# Altium project DoorCard_v0.1.PrjPcb
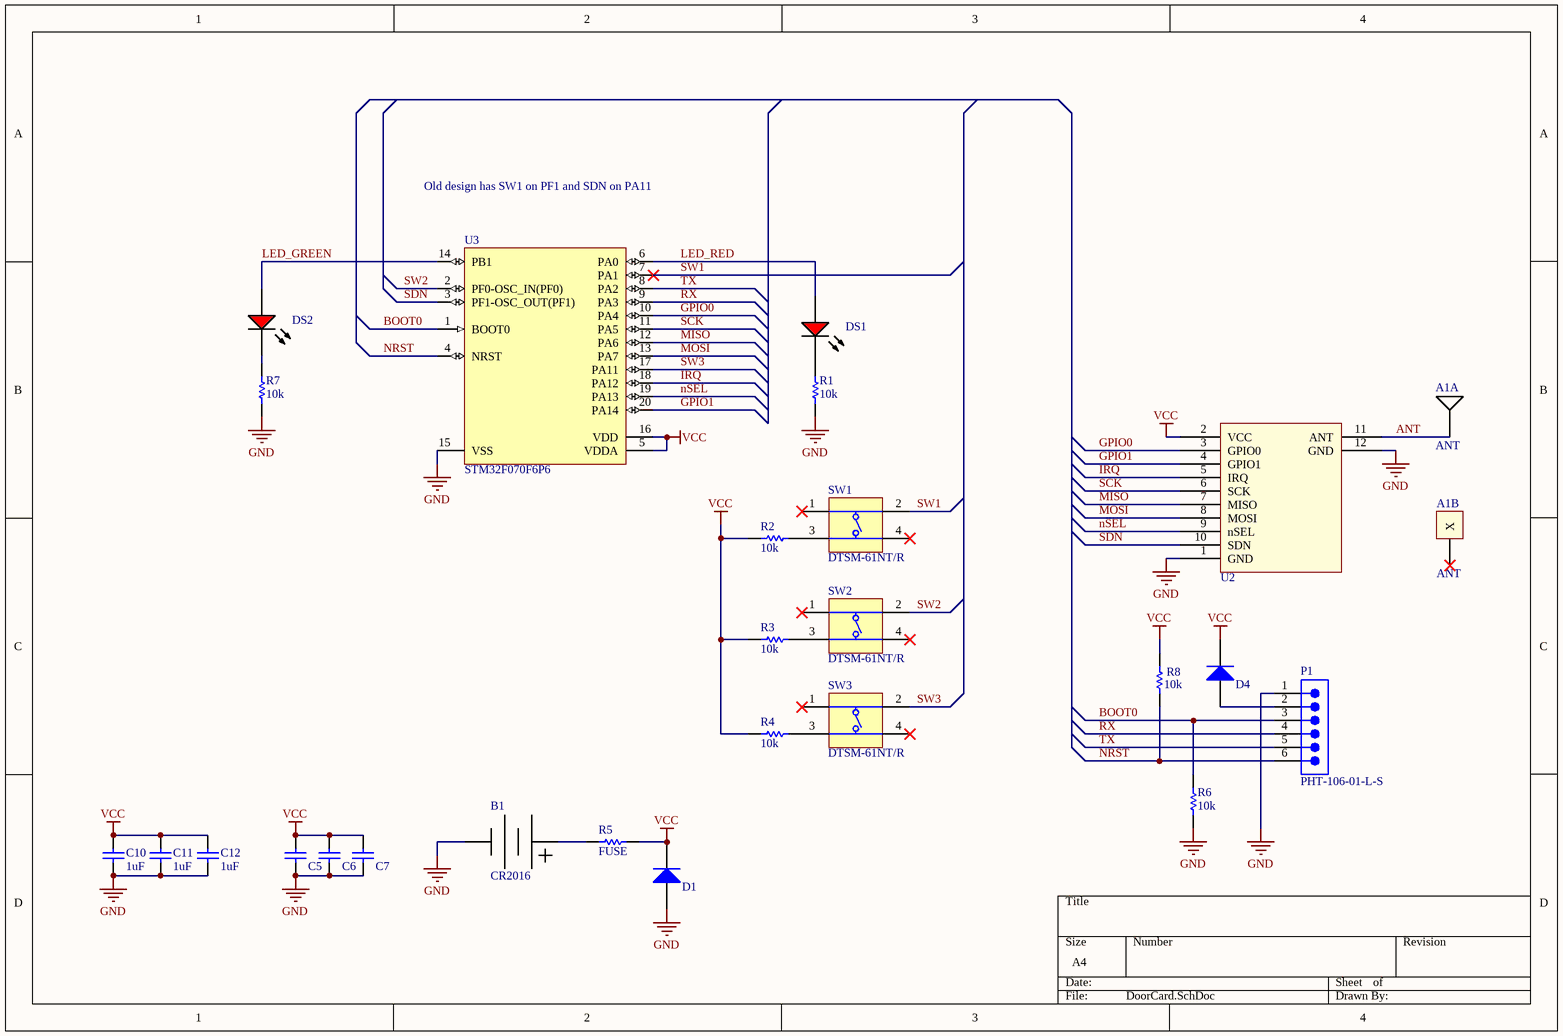
[diagram p0: DoorCard.SchDoc]
1 sheet, 26 parts. Net scope: global (net labels, ports and power ports of the same name join across sheets).
Board file: doorCard.PcbDoc

## Sheet DoorCard.SchDoc
size A4

### Parts
A1  ANT  [433MHz_Antenna]  (parts A,B of 2)
B1  CR2016  [CR2012]
C5  CAP 47uF 6.3V 1206(3216)  [CAPC1206(3216)190_M]  (value not drawn)
C6  CAP 47uF 6.3V 1206(3216)  [CAPC1206(3216)190_M]  (value not drawn)
C7  CAP 47uF 6.3V 1206(3216)  [CAPC1206(3216)190_M]  (value not drawn)
C10  1uF  [CAPC0805(2012)100_M]
C11  1uF  [CAPC0805(2012)100_M]
C12  1uF  [CAPC0805(2012)100_M]
D1  MMSD4148T3G  [ONSC-SOD123-2-425G-04_V]  (value not drawn)
D4  MMSD4148T3G  [ONSC-SOD123-2-425G-04_V]  (value not drawn)
DS1  TLMS1100-GS08  [VISH-TLMX1100_V]  (value not drawn)
DS2  TLMS1100-GS08  [VISH-TLMX1100_V]  (value not drawn)
P1  PHT-106-01-L-S  [SMTC-PHT-106-01-X-S]
R1  10k  [RESC0805(2012)_L]
R2  10k  [RESC0805(2012)_L]
R3  10k  [RESC0805(2012)_L]
R4  10k  [RESC0805(2012)_L]
R5  FUSE  [RESC0805(2012)_L]
R6  10k  [RESC0805(2012)_L]
R7  10k  [RESC0805(2012)_L]
R8  10k  [RESC0805(2012)_L]
SW1  DTSM-61NT/R  [DIPT-DTSM-6_V]
SW2  DTSM-61NT/R  [DIPT-DTSM-6_V]
SW3  DTSM-61NT/R  [DIPT-DTSM-6_V]
U2  Si4463  [E10-433MS]  (value not drawn)
U3  STM32F070F6P6  [STM-TSSOP20_M]

### Nets
GND: B1.2 C5.1 C6.1 C7.1 C10.1 C11.1 C12.1 D1.2(ANODE) P1.1 R1.1 R6.1 R7.1 U2.1(GND) U2.12(GND) U3.15(VSS)
VCC: C5.2 C6.2 C7.2 C10.2 C11.2 C12.2 D1.1(CATHODE) D4.1(CATHODE) R2.2 R3.1 R4.2 R5.1 R8.2 U2.2(VCC) U3.5(VDDA) U3.16(VDD)
ANT: A1.1(ANT) U2.11(ANT)
BOOT0: P1.3 R6.2 U3.1(BOOT0)
GPIO0: U2.3(GPIO0) U3.10(PA4)
GPIO1: U2.4(GPIO1) U3.20(PA14)
IRQ: U2.5(IRQ) U3.18(PA12)
LED_GREEN: DS2.1(A) U3.14(PB1)
LED_RED: DS1.1(A) U3.6(PA0)
MISO: U2.7(MISO) U3.12(PA6)
MOSI: U2.8(MOSI) U3.13(PA7)
NRST: P1.6 R8.1 U3.4(NRST)
nSEL: U2.9(nSEL) U3.19(PA13)
RX: P1.4 U3.9(PA3)
SCK: U2.6(SCK) U3.11(PA5)
SDN: U2.10(SDN) U3.3(PF1-OSC_OUT(PF1))
SW1: SW1.2(T2) U3.7(PA1)
SW2: SW2.2(T2) U3.2(PF0-OSC_IN(PF0))
SW3: SW3.2(T2) U3.17(PA11)
TX: P1.5 U3.8(PA2)
NetB1_1: B1.1 R5.2
NetD4_2: D4.2(ANODE) P1.2
NetDS1_2: DS1.2(K) R1.2
NetDS2_2: DS2.2(K) R7.2
NetR2_1: R2.1 SW1.3(T3)
NetR3_2: R3.2 SW2.3(T3)
NetR4_1: R4.1 SW3.3(T3)

Not connected (* = marked no-connect by the designer): A1 2(X)*; SW1 1(T1)* 4(T3)*; SW2 1(T1)* 4(T3)*; SW3 1(T1)* 4(T3)*

### Notes on the sheet
- Old design has SW1 on PF1 and SDN on PA11

### Library data of the parts
A1 = ANT1204F002R0433A
B1 = BAT-HLD-002-SMT
C5-C7 = CMP-1037-05000-1: CAP 47uF 6.3V ±20% 1206 (3216 Metric) Thickness 1.9mm SMD; Case-EIA: 1206; Case-Metric: 3216; Tolerance: Â±20%; Max Thickness: 1.9 mm; Value: 47uF; Technology: SMT; Rated Voltage: 6.3 V
C10-C12 = CMP-1036-04754-1: CAP 1uF 25V ±10% 0805 (2012 Metric) Thickness 1mm SMD; Case-EIA: 0805; Case-Metric: 2012; Tolerance: Â±10%; Max Thickness: 1 mm; Value: 1uF; Rated Voltage: 25 V; Technology: SMT
D1 D4 = CMP-0895-00002-1: Switching Diode, 100 V, 200 mA, -55 to 150 degC, 2-Pin SOD123 (425), RoHS, Tape and Reel; Manufacturer: ON Semiconductor; CD (Max): 4 pF; IR @ VR: 75 V (Max)=50 uA; PD (Max): 425 mW; VF (Max): 1 A; Trr (Max): 4 ns; VBR (Min): 100 V; ComponentLink1URL: http://www.onsemi.com/; ComponentLink1Description: Manufacturer URL; PackageReference: SOD123-2-425G-04; PackageDescription: 2-Pin SOD123, Body 2.69 x 1.6 mm, Height 1.35 mm; ComponentLink2Description: Datasheet; Mounting Technology: Surface Mount; RoHS: TRUE; PartNumber: MMSD4148T3G; PackageVersion: Rev. 04G; DatasheetVersion: Rev. 11; Temperature Range: -55 to 150 degC; ComponentLink3Description: Package Specification; Packing: Tape and Reel; ComponentLink3URL: http://www.onsemi.com/pub_link/Collateral/425-04.PDF; ComponentLink2URL: http://www.onsemi.com/pub_link/Collateral/MMSD4148T1-D.PDF
DS1 DS2 = CMP-1666-00027-1: LED, RED, 2.1 V, -40 to 100 degC, 2-Pin SMD (0603), RoHS, Tape and Reel; Type (Capacitors): C0G; Resistance: 100000000000 Ohm; Capacitance: 12 pF; Voltage Rating: 50 V; Tolerance: 5%; Min Operating Temperature: -55degC; REACH SVHC: No SVHC; ComponentLink2Description: Datasheet; ComponentLink1URL: http://www.vishay.com/; Width: 0.8 mm; Package Quantity: 4000; PackageReference: TLMX1100; ComponentLink2URL: http://www.vishay.com/docs/83173/tlmb1100.pdf; Case/Package: 0603; Case Code (Metric): 1608; Packaging: Tape and Reel; Pins: 2; ComponentLink1Description: Manufacturer URL; Max Operating Temperature: 125degC; Height: 0.8 mm; Length: 1.6 mm; Mount: Surface Mount; PackageDescription: 2-Pin Surface Mount Device, Body 1.6 x 0.8 mm; DatasheetVersion: Rev. 2.7, 03/2016; Case Code (Imperial): 0603; Voltage Rating (DC): 50 V; RoHSCompliant: True; Radiation Hardening: No
P1 = CMP-1024-00187-1: Press Fit Header, Through-hole, Vertical, -55 to 125 degC, 2.54 mm Pitch, 6-Pin, Male, RoHS; Manufacturer: Samtec; Pitch: 2.54 mm; PackageReference: PHT-106-01-X-S; PackageDescription: .100 Press Fit Socket Assembly; ComponentLink3URL: http://www.samtec.com/documents/webfiles/cpdf/PHT-1XX-XX-X-X-XXX-MKT.pdf; PackageVersion: J, 9/2009; ComponentLink3Description: Package Specification; PartNumber: PHT-106-01-L-S; ComponentLink1Description: Manufacturer URL; Orientation: Vertical; Mounting Technology: Through-hole; ComponentLink1URL: http://www.samtec.com; ComponentLink2URL: http://www.samtec.com/documents/webfiles/pdf/pht.pdf; Temperature Range: -55 to 125 degC; RoHS: True; DatasheetVersion: F-214; ComponentLink2Description: Datasheet
R1-R4 R6-R8 = CMP-1013-00624-1: 10K2 0.125W 1% 0805 (2012 Metric)  SMD; Case-Metric: 2012; Case-EIA: 0805; Value: 10200.00 Ohm; Technology: SMT; Tolerance: 1 %; Power: 0.125 W
R5 = CMP-1013-00624-1: PTC Fuse; Case-Metric: 2012; Case-EIA: 0805; Value: 10200.00 Ohm; Tolerance: 1 %; Power: 0.125 W; Technology: SMT
SW1-SW3 = CMP-0306-00001-1: Switch, SPNO Push Button SMD; Manufacturer: Diptronics; Packing Type: Tape&Reel; Mechanical Life: 200,000 cycles; ComponentLink2URL: http://www.dip.com.tw/Products_tact.htm; ComponentLink1URL: http://www.dip.com.tw/; ComponentLink3URL: http://www.dip.com.tw/PDF/pro_tact/DTSM_G_-6_2_-V.pdf; PackageDescription: Switch, Through-Hole, 4 Leads, Body 8.5x8.5mm, Row Spacing 9.0mm, Pitch 4.5mm; ComponentLink2Description: Datasheet; ComponentLink3Description: Package Specification; ComponentLink1Description: Manufacturer URL; PackageReference: DTSM-6; PartNumber: DTSM-61NT/R; Mounting Technology: Through Hole
U2 = Component_1: E10-433MS
U3 = CMP-0304-00145-2: ARM Cortex-M0 32-bit MCU, 32 KB Flash, 6 KB Internal RAM, 15 I/Os, 20-Pin TSSOP, -40 to 85 degC, Tray; Manufacturer: STMicroelectronics; FLASH Size (Prog) (kB): 32; Internal RAM Size (kB): 6; Operating Frequency(F) (Processor speed) (MHz): 48; Supply Voltage(Vcc) min (V): 2.4; I/Os (High Current): 15; ComponentLink2URL: http://www.st.com/st-web-ui/static/active/en/resource/technical/document/datasheet/DM00141386.pdf; ComponentLink2Description: Datasheet; Packing: Tray; DatasheetVersion: Rev. 3; PartNumber: STM32F070F6P6; Core: ARM Cortex-M0; Package Reference: TSSOP20; Package Description: 20-Pin Thin Shrink Small Outline Package, Body 6.5 x 4.4 mm, Pitch 0.65 mm; ComponentLink1Description: Manufacturer URL; ComponentLink1URL: http://www.st.com/; Mounting Technology: Surface Mount